# EAGLE schematic Fonte (EAGLE 7.2.0)
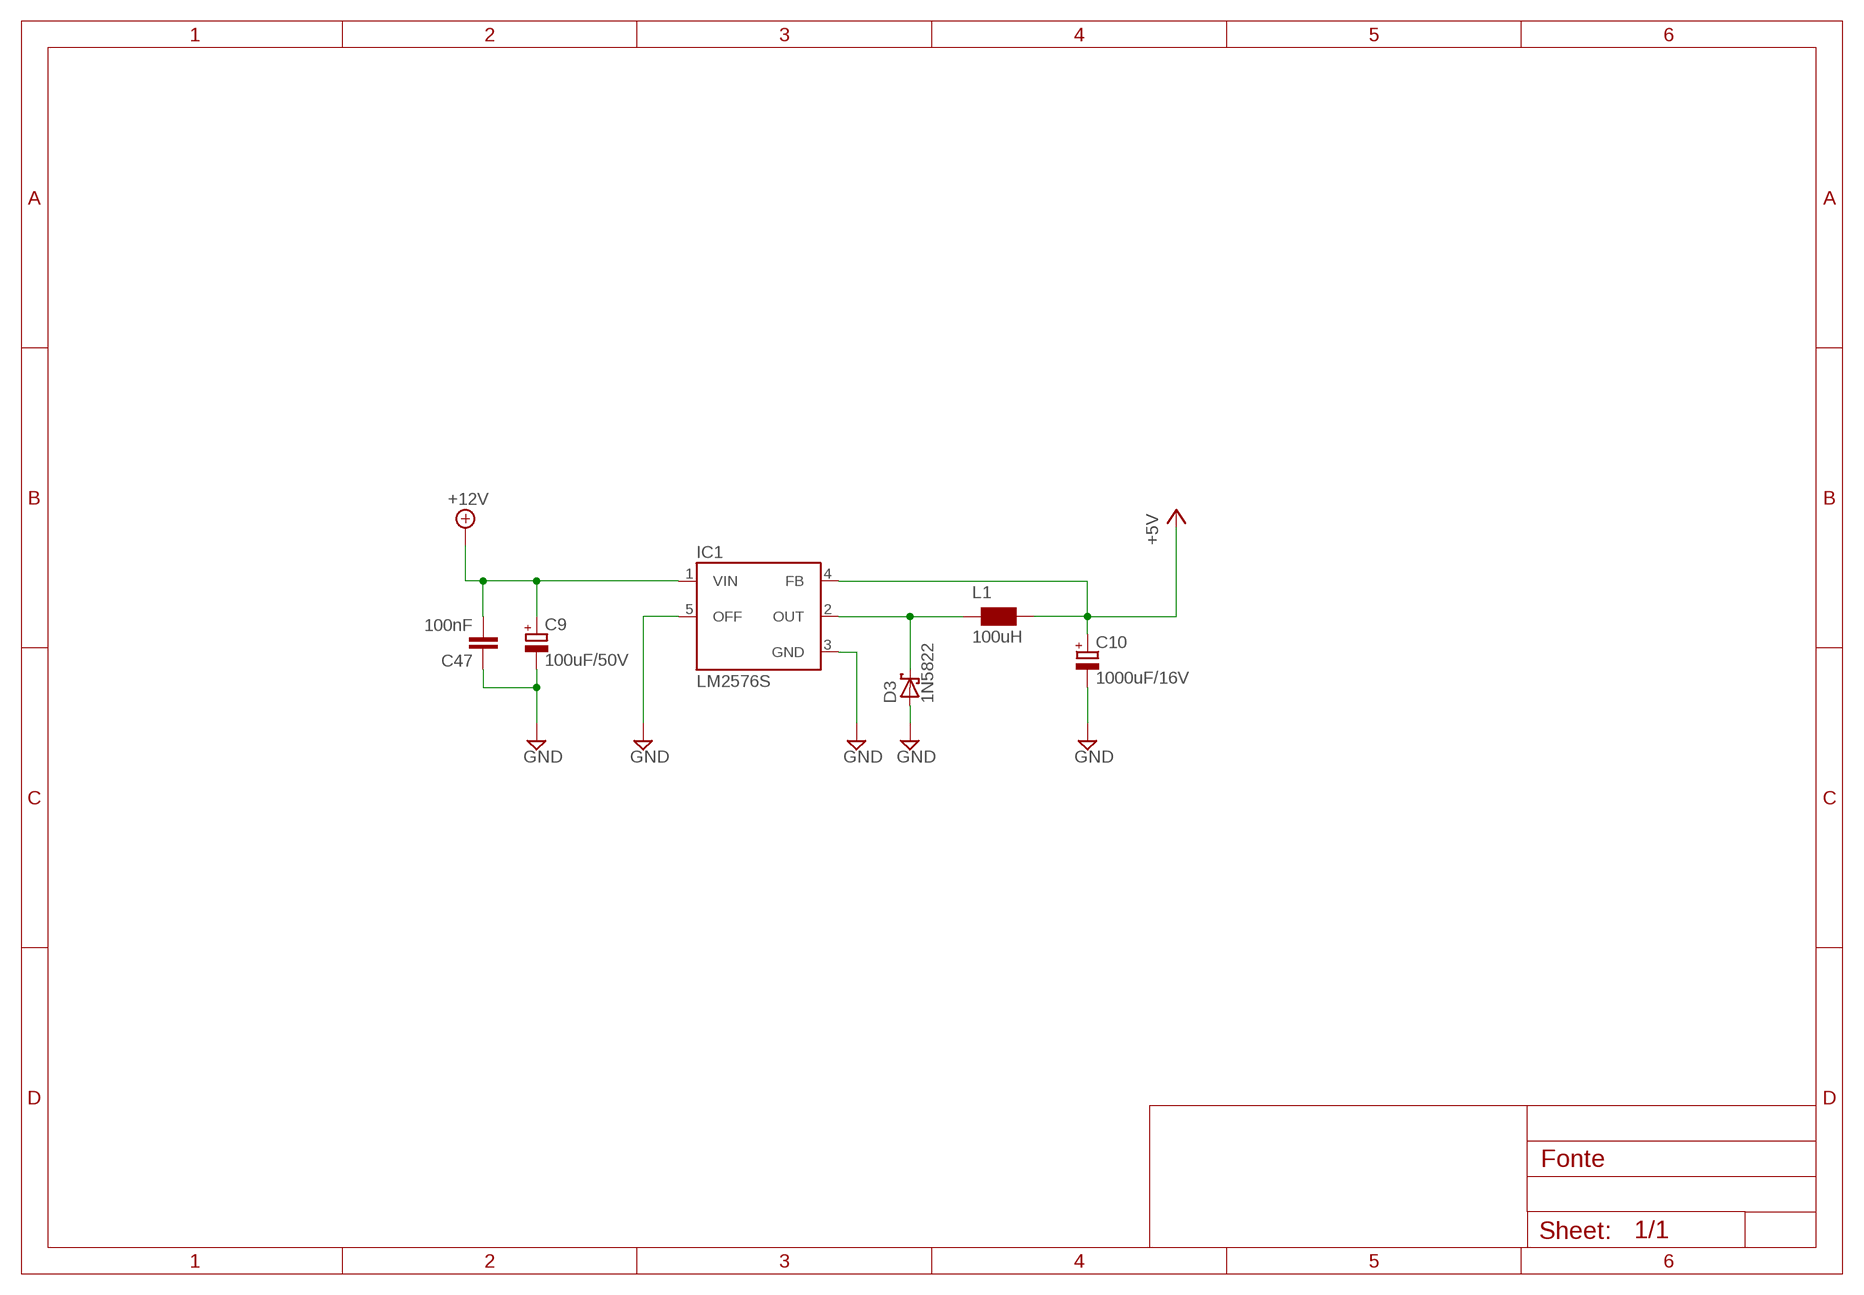
[diagram p0: schematic, sheet 1]

## Parts
C9  100uF/50V  CPOL-EUE3.5-8  [E3,5-8]
C10  1000uF/16V  CPOL-EUE5-10.5  [E5-10,5]
C47  100nF  C-EUC0805  [C0805]
D3  1N5822  SCHOTTKY-DIODEDO201T15  [DO201T15]
IC1  LM2576S  [TO263-5]
L1  100uH  WE-PD4_L  [L]

## Nets
+5V: C10.+ IC1.4(FB) L1.1
+12V: C9.+ C47.2 IC1.1(VIN)
GND: C9.- C10.- C47.1 D3.A IC1.3(GND) IC1.5(OFF)
N$85: D3.C IC1.2(OUT) L1.2

## Library data of the parts
C9 C10 = rcl:CPOL-EU: POLARIZED CAPACITOR, European symbol
C47 = rcl:C-EU: CAPACITOR, European symbol
D3 = diode_ebx:SCHOTTKY-DIODE: Schottky Diode
IC1 = v-reg-3:LM2576: National Semiconductor <http://www.national.com> 3.0A "Simple Switcher"(c) 52kHz, Vout 1.23-37V (HV: 57V), Vin 40V (HV: 60V), 50µA standby current
L1 = wuerth-elektronik:WE-PD4: SMD-Power Inductors WE-PD4 Is recommended for the application with switching regulators from National Semiconductor, Linear Technology, Texas Instruments and Fairchild Semiconductor - Current loading up to 35 A - Compact size - Low-loss ferrite core - High storage capacity